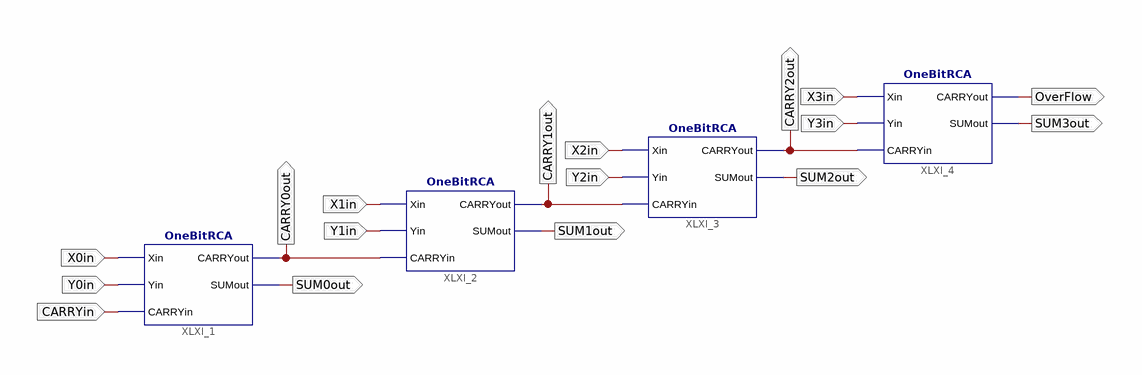
[diagram p0: schematic sheet 1]
// Xilinx ISE schematic FourBitRCA.sch (spartan6) as structural Verilog: 4 symbols, 17 ports
module FourBitRCA (
  input  X1in,
  input  Y1in,
  input  CARRYin,
  input  Y0in,
  input  X0in,
  input  X2in,
  input  Y2in,
  input  Y3in,
  input  X3in,
  output SUM1out,
  output CARRY0out,
  output SUM0out,
  output SUM2out,
  output CARRY1out,
  output SUM3out,
  output OverFlow,
  output CARRY2out
);

  OneBitRCA XLXI_1 (.Xin(X0in), .Yin(Y0in), .CARRYin(CARRYin), .SUMout(SUM0out), .CARRYout(CARRY0out));
  OneBitRCA XLXI_2 (.Xin(X1in), .Yin(Y1in), .CARRYin(CARRY0out), .SUMout(SUM1out), .CARRYout(CARRY1out));
  OneBitRCA XLXI_3 (.Xin(X2in), .Yin(Y2in), .CARRYin(CARRY1out), .SUMout(SUM2out), .CARRYout(CARRY2out));
  OneBitRCA XLXI_4 (.Xin(X3in), .Yin(Y3in), .CARRYin(CARRY2out), .SUMout(SUM3out), .CARRYout(OverFlow));
endmodule
